# Altium schematic sheet Power.SchDoc
size A4; DocumentNumber: 2; SheetNumber: 4; SheetTotal: 4
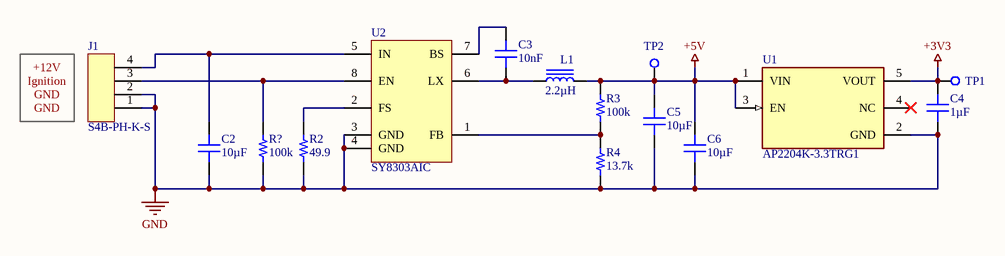
[diagram p0: Power.SchDoc]

## Parts
C2  Capacitance: 10µF  [CAPC3216X16N]  (hidden comment: CL31A106KAHNNNE)
C3  Capacitance: 10nF  [CAPC1608X08N]  (hidden comment: CC0603KRX7R9BB103)
C4  Capacitance: 1µF  [CAPC1608X08N]  (hidden comment: GRM185R61C105KE44D)
C5  Capacitance: 10µF  [CAPC2012X13N]  (hidden comment: CL21B106KOQNNNE)
C6  Capacitance: 10µF  [CAPC2012X13N]  (hidden comment: CL21B106KOQNNNE)
J1  S4B-PH-K-S  [S4B-PH-K-S]
L1  Inductance: 2.2µH  [INDP5852X48N]  (hidden comment: CMLF0504-2R2MTT)
R2  Resistance: 49.9  [RESC1608X06N]  (hidden comment: RC0603FR-0749R9L)
R3  Resistance: 100k  [RESC1608X06N]  (hidden comment: RC0603FR-13100KL)
R4  Resistance: 13.7k  [RESC1608X06N]  (hidden comment: RC0603FR-0713K7L)
R?  Resistance: 100k  [RESC1608X06N]  (hidden comment: RC0603FR-13100KL)
TP1  TP_TH_1MM  [TP_TH_1MM_N]  (value not drawn)
TP2  TP_TH_1MM  [TP_TH_1MM_N]  (value not drawn)
U1  AP2204K-3.3TRG1  [FP-SOT25-IPC_B]
U2  SY8303AIC  [SOT65P280X110-8N]

## Nets
+3V3: C4.2 TP1.1(TP) U1.5(VOUT)
+5V: C5.1 C6.1 L1.2 R3.2 TP2.1(TP) U1.1(VIN) U1.3(EN)
GND: C2.2 C4.1 C5.2 C6.2 J1.1 J1.2 R2.1 R4.1 R?.1 U1.2(GND) U2.3(GND) U2.4(GND)
NetC2_1: C2.1 J1.4 U2.5(IN)
NetC3_1: C3.1 L1.1 U2.6(LX)
NetC3_2: C3.2 U2.7(BS)
NetJ1_3: J1.3 R?.2 U2.8(EN)
NetR2_2: R2.2 U2.2(FS)
NetR3_1: R3.1 R4.2 U2.1(FB)

Not connected (* = marked no-connect by the designer): U1 4(NC)*

## Notes on the sheet
- (near J1) Ignition
- +12V
- GND
- Title:
- Author:
- Approved:
- Size:
- Date:
- Git Hash:
- A4
- Prj:
- SW Version:
- Variant:
- Edited:
- CONFIDENTIAL
- File:

## Library data of the parts
C2 = CMP-178-0009-1: CAP CER 10UF 25V X5R 1206; Manufacturer: Samsung Electro-Mechanics; Tolerance: 10%; Max Operating Temperature: 85°C; Case/Package: 1206; Case Code (Metric): 3216; Contact Plating: Tin; Depth: 1.6mm; Number of Pins: 2; Height: 1.6mm; Voltage: 25V; Voltage Rating: 25V; Dielectric Material: X5R; Lead Free: Lead Free; Dielectric: X5R; Width: 1.6002mm; Voltage Rating (DC): 25V; Case Code (Imperial): 1206; Min Operating Temperature: -55°C; Length: 3.2mm; Radiation Hardening: No; Thickness: 1.8034mm; Packaging: Tape and Reel; Mount: Surface Mount; Manufacturer Part Number: CL31A106KAHNNNE
C3 = CMP-178-0014-1: 10nF ±10% 50V X7R 0603 Multilayer Ceramic Capacitors MLCC - SMD/SMT RoHS; Manufacturer: Yageo; Insulation Resistance: 100G; Tolerance: 10%; Case Code (Imperial): 0603; Number of Pins: 2; Packaging: Tape and Reel; Voltage Rating (DC): 50V; Case/Package: 0603; Voltage: 50V; REACH SVHC: No SVHC; Manufacturer Part Number: CC0603KRX7R9BB103; Package Quantity: 1; Min Operating Temperature: -55°C; Mount: Surface Mount; Voltage Rating: 50V; Thickness: 889µm; Radiation Hardening: No; Lead Free: Lead Free; Width: 787.4µm; Case Code (Metric): 1608; Termination: SMD/SMT; Halogen Free: Halogen Free; Depth: 800µm; Height: 800µm; Length: 1.6mm; Max Operating Temperature: 125°C; Dielectric: X7R
C4 = CMP-178-0007-2: GRM185R61C105KE44D <CA; Manufacturer: Murata; Voltage: 16V; Dielectric Material: X5R; Tolerance: 10%; Depth: 800µm; Termination: SMD/SMT; Height: 500µm; Lead Free: Lead Free; Case/Package: 0603; Case Code (Imperial): 0603; Max Operating Temperature: 85°C; Voltage Rating: 16V; Min Operating Temperature: -55°C; Mount: Surface Mount; Number of Pins: 2; Packaging: Tape and Reel; Width: 800µm; Radiation Hardening: No; Package Quantity: 1; Thickness: 508µm; Dielectric: X5R; Voltage Rating (DC): 16V; Case Code (Metric): 1608; Manufacturer Part Number: GRM185R61C105KE44D; Length: 1.6mm; REACH SVHC: No SVHC
C5 C6 = CMP-178-0005-2: SAMSUNG ELECTRO-MECHANICS - CL21B106KOQNNNE. - CAP, 10UF, 16V, MLCC, 0805; Dielectric Material: X7R; Tolerance: 10%; Packaging: Tape and Reel; Package Quantity: 1; Dielectric: X7R; Mount: Surface Mount; Case Code (Imperial): 0805; Thickness: 1.397mm; Min Operating Temperature: -55°C; Length: 2mm; Manufacturer Part Number: CL21B106KOQNNNE; Voltage: 16V; Radiation Hardening: No; Number of Pins: 2; Depth: 1.25mm; Voltage Rating (DC): 16V; Height: 1.25mm; Max Operating Temperature: 125°C; Contact Plating: Tin; Case/Package: 0805; Case Code (Metric): 2012; Width: 1.2446mm; Voltage Rating: 16V; Manufacturer: SAMSUNG ELECTRO-MECHANICS
J1 = CMP-00003-3: JST (JAPAN SOLDERLESS TERMINALS) - S4B-PH-K-S (LF)(SN) - CONNECTOR, HEADER, 2MM, 4 POSITION, 1ROW; Voltage Rating: 100V; Number of Positions: 4; Insulation Resistance: 1G; Gender: Male; Max Current Rating: 2A; Contact Resistance: 10m; Connector Type: Male Pin; Mount: Through Hole; REACH SVHC: No SVHC; Height: 9.4mm; Fastening Type: Detent; Length: 9.9mm; Contact Plating: Tin; Flammability Rating: UL94 V-0; Max Operating Temperature: 85°C; Width: 4.5mm; Color: Natural,White; Working Voltage: 100V; Number of Pins: 4; Lead Free: Lead Free; Lead Pitch: 2mm; Voltage Rating (AC): 100V; Operating Supply Voltage: 100V; Number of Poles: 4; Termination: Solder; Number of Rows: 1; Max Voltage Rating (DC): 100V; Housing Color: Natural; Max Voltage Rating (AC): 100V; Contact Mating Length: 0.13inch; Pitch: 2mm; Number of Contacts: 4; Packaging: Bulk; Current: 2A; Current Rating: 2A; Orientation: Right Angle; Voltage: 100V; Voltage Rating (DC): 100V; Min Operating Temperature: -25°C; Contact Material: Tin,Brass,Bronze
L1 = CMP-167-0004-1: 2.2uH ±20% 4.8A 35mΩ SMD,5.8x5.2x4.5mm Power Inductors RoHS; Manufacturer: Cybermax; Core Material: Ferrite; Current Rating: 3.8A; DC Resistance (DCR): 35m; RMS Current (Irms): 3A; Length: 5.8mm; Saturation Current: 3.8A; Manufacturer Part Number: CMLF0504-2R2MTT; Mount: SMT; Case/Package: 5.8*5.2*4.5; Height: 4.5mm; Inductance Tolerance: 20%; Height - Seated (Max): 4.5mm; Tolerance: 20%; Current: 3.8A; Width: 5.2mm; Max DC Current: 3.8A; Number of Pins: 2; DC Current: 3.8A
R2 = CMP-186-0012-3: Yageo RC Series Thick Film Surface Mount Resistor 0603 Case 49.9 1% 0.1W 100ppm/C; Temperature Coefficient: 100ppm/°C; Voltage Rating: 50V; Power Rating: 100mW; Case Code (Imperial): 0603; Lead Free: Lead Free; Case/Package: 0603; Case Code (Metric): 1608; Depth: 800µm; Max Operating Temperature: 155°C; Length: 1.6mm; Tolerance: 1%; Manufacturer: Yageo; Military Standard: Not; Manufacturer Part Number: RC0603FR-0749R9L; REACH SVHC: No SVHC; Min Operating Temperature: -55°C; Number of Pins: 2; Termination: SMD/SMT; Voltage Rating (DC): 50V; Packaging: Tape and Reel; Composition: Thick Film; Height: 450µm
R3 R? = CMP-186-0032-1: Res Thick Film 0603 100K Ohm 1% 0.1W(1/10W) ±100ppm/C Pad SMD T/R; Manufacturer: Yageo; Voltage Rating: 50V; Power Rating: 100mW; Number of Contacts: 2; Temperature Coefficient: 100ppm/°C; Mount: SMT; Resistor Type: Thick Film; Length: 1.6mm; Lead Free: Lead Free; Depth: 800µm; Height: 450µm; Width: 800µm; Case/Package: 0603; Voltage Rating (DC): 50V; REACH SVHC: Unknown; Number of Terminations: 2; Tolerance: 1%; Military Standard: Not; Case Code (Imperial): 0603; Termination: SMD/SMT; Packaging: Tape and Reel; Manufacturer Part Number: RC0603FR-13100KL; Number of Pins: 2; Min Operating Temperature: -55°C; Max Operating Temperature: 155°C; Case Code (Metric): 1608
R4 = CMP-186-0033-1: 13.7kΩ ±1% 0.1W ±100ppm/℃ 0603 Chip Resistor - Surface Mount RoHS; Manufacturer: Yageo; Voltage Rating: 75V; Temperature Coefficient: 100ppm/°C; Number of Contacts: 2; Voltage Rating (DC): 50V; Power Rating: 100mW; Width: 800µm; Military Standard: Not; Weight: 2.0128mg; Case/Package: 0603; Length: 1.6mm; Case Code (Imperial): 0603; Lead Free: Lead Free; Number of Pins: 2; Depth: 800µm; Max Operating Temperature: 155°C; Height: 450µm; Packaging: Tape and Reel; Manufacturer Part Number: RC0603FR-0713K7L; Termination: SMD/SMT; Tolerance: 1%; Number of Terminations: 2; Case Code (Metric): 1608; Mount: SMT; Min Operating Temperature: -55°C
TP1 TP2 = CMP-001-0001-1: Test point, 1mm, TH; Test signal: Test
U1 = CMP-2000-05782-2: IC REG LINEAR 3.3V 150MA SOT23-5; Max Input Voltage: 24V; Min Input Voltage: 2.3V; Quiescent Current: 50uA; Number of Regulators: 1; Max Output Current: 250mA; Reference Voltage: 1.24V; Output Type: Fixed; Polarity: Positive; Dropout Voltage: 360mV; Weight: 0.001058oz; Min Operating Temperature: -40°C; Output Current: 150mA; Lead Free: Lead Free; Length: 3.02mm; Height: 1.3mm; Width: 1.7mm; Case/Package: SOT-23-5; Max Operating Temperature: 85°C; Package Quantity: 3000; Mount: Surface Mount; Output Voltage: 3.3V; Number of Pins: 5; Packaging: Tape and Reel; Number of Outputs: 1
U2 = CMP-126-0005-3: High Efficiency, Fast Response, 3A, 40V Input, Synchronous Step Down Regulator; Manufacturer: Silergy; Min Input Voltage (DC): 4.5V; Frequency: 2.5MHz; Number of Outputs: 1; Efficiency: 98; Height: 1.1mm; Width: 3mm; Max Input Voltage: 40V; Case/Package: TSOT23-8; Length: 3mm; Number of Pins: 8; Max Input Voltage (DC): 40V; Current - Output 1: 3A; Output Current: 3A; Min Input Voltage: 4.5V; Manufacturer Part Number: SY8303AIC; Max Operating Temperature: 105°C; Max Output Current: 3A; Mount: SMT; Min Operating Temperature: -40°C